# EAGLE schematic dubBoardScratch (EAGLE 6.5.0)
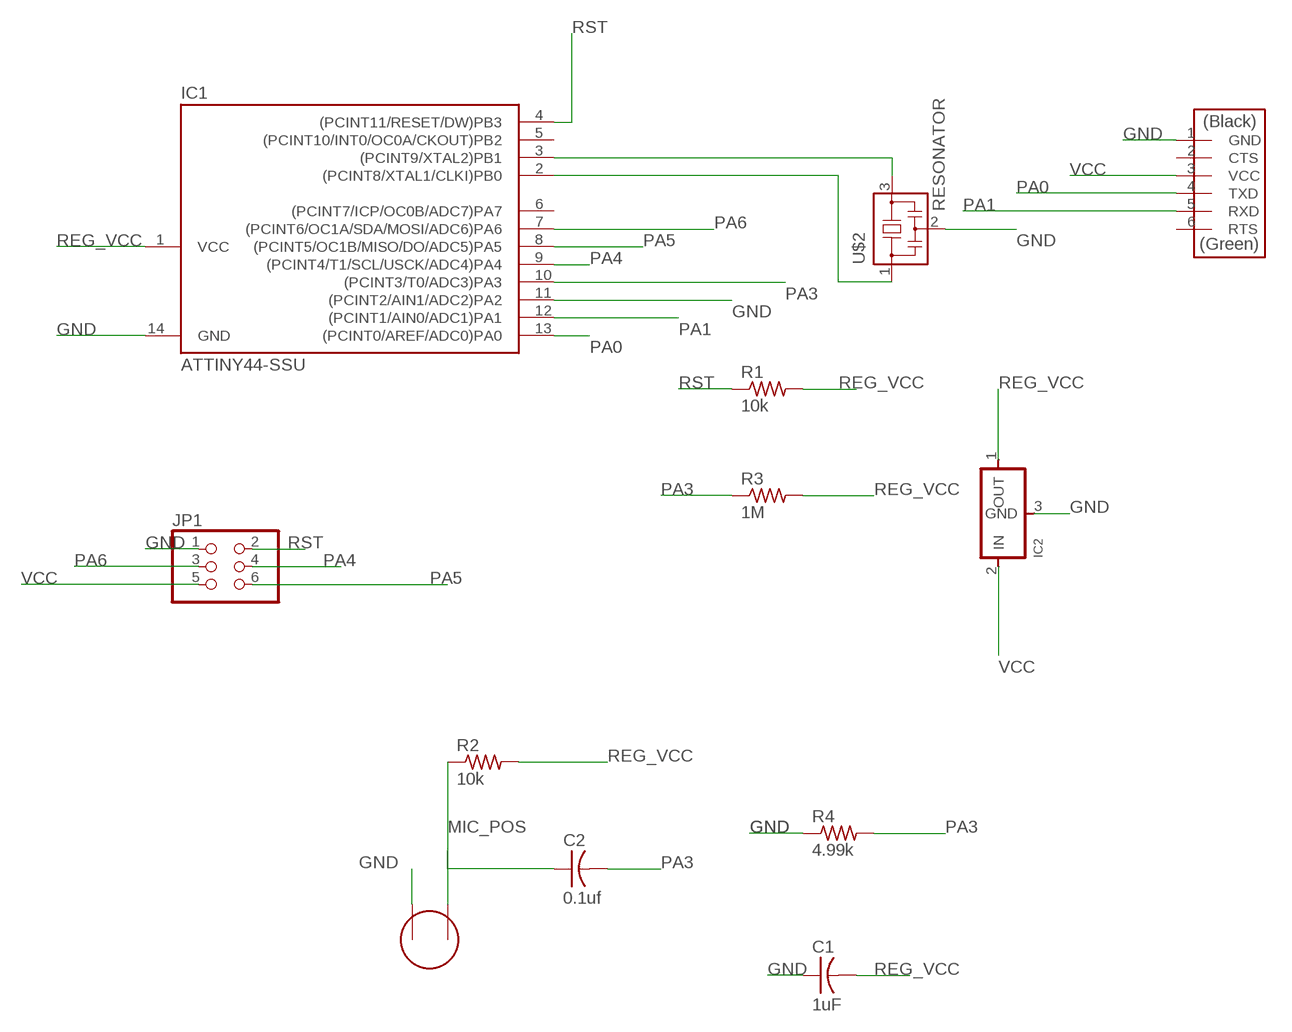
[diagram p0: schematic, sheet 1]

## Parts
C1  1uF  CAP-US1206FAB  [C1206FAB]
C2  0.1uf  CAP-US1206FAB  [C1206FAB]
IC1  ATTINY44-SSU  [SOIC14]
IC2  REGULATORSOT23  [SOT23]
JP1  PINHD-2X3-SMD  [2X03SMD]
R1  10k  RES-US1206FAB  [R1206FAB]
R2  10k  RES-US1206FAB  [R1206FAB]
R3  1M  RES-US1206FAB  [R1206FAB]
R4  4.99k  RES-US1206FAB  [R1206FAB]
U$1  FTDI-SMD-HEADER  [1X06SMD]
U$2  RESONATOR  [EFOBM]
U$3  ELECTRET  [ELECTRET_2742PBJ-A]

## Nets
GND: C1.1 IC1.11((PCINT2/AIN1/ADC2)PA2) IC1.14(GND) IC2.3(GND) JP1.1 R4.1 U$1.1(GND) U$2.2 U$3.P$2
MIC_POS: C2.1 R2.1 U$3.P$1
N$1: IC1.3((PCINT9/XTAL2)PB1) U$2.3
N$2: IC1.2((PCINT8/XTAL1/CLKI)PB0) U$2.1
PA0: IC1.13((PCINT0/AREF/ADC0)PA0) U$1.4(TXD)
PA1: IC1.12((PCINT1/AIN0/ADC1)PA1) U$1.5(RXD)
PA3: C2.2 IC1.10((PCINT3/T0/ADC3)PA3) R3.1 R4.2
PA4: IC1.9((PCINT4/T1/SCL/USCK/ADC4)PA4) JP1.4
PA5: IC1.8((PCINT5/OC1B/MISO/DO/ADC5)PA5) JP1.6
PA6: IC1.7((PCINT6/OC1A/SDA/MOSI/ADC6)PA6) JP1.3
REG_VCC: C1.2 IC1.1(VCC) IC2.1(OUT) R1.2 R2.2 R3.2
RST: IC1.4((PCINT11/RESET/DW)PB3) JP1.2 R1.1
VCC: IC2.2(IN) JP1.5 U$1.3(VCC)
Unconnected: IC1.5((PCINT10/INT0/OC0A/CKOUT)PB2) IC1.6((PCINT7/ICP/OC0B/ADC7)PA7) U$1.2(CTS) U$1.6(RTS)

## Library data of the parts
C1 C2 = fab:CAP-US
IC1 = fab:ATTINY44
IC2 = fab:REGULATOR
JP1 = fab:PINHD-2X3-SMD: PIN HEADER
R1-R4 = fab:RES-US: Resistor (US Symbol) Variants with postfix FAB are widened to allow the routing of internal traces
U$1 = fab:FTDI-SMD-HEADER
U$2 = fab:RESONATOR
U$3 = fab:ELECTRET